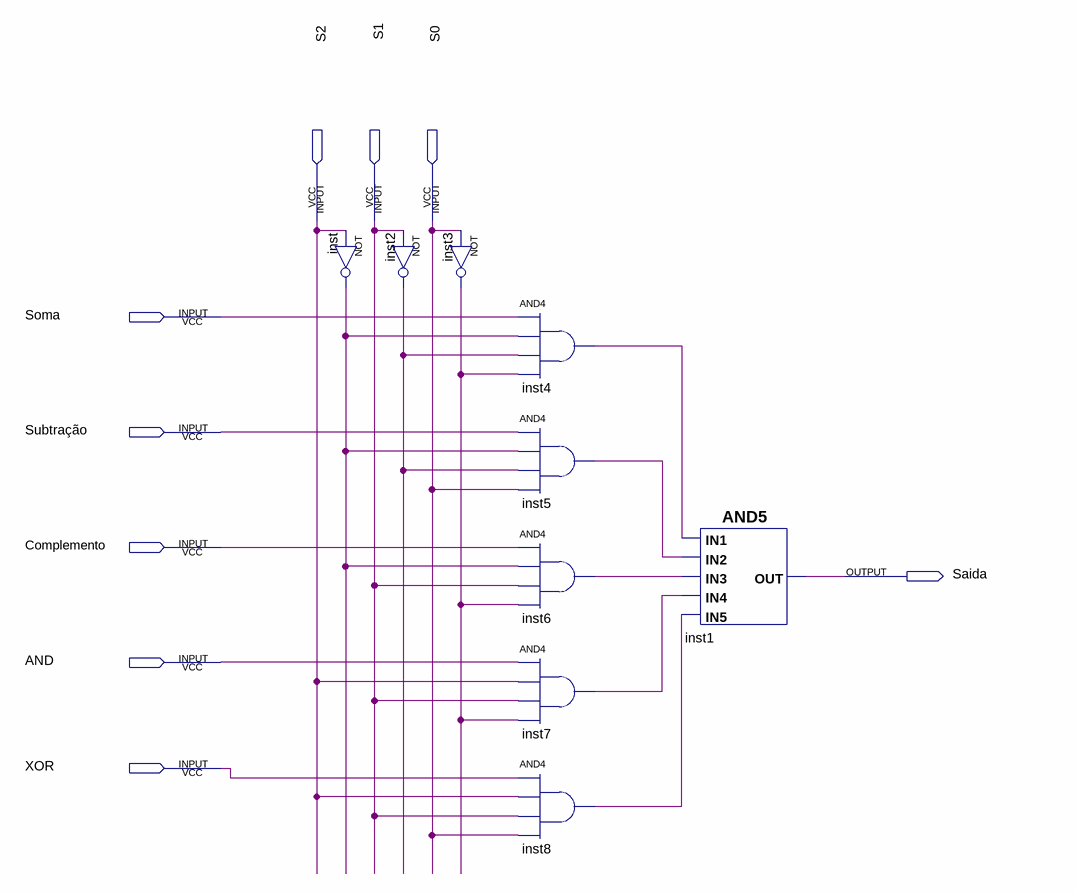
[diagram p0: schematic sheet]
// Quartus schematic Multiplexador_4bits.bdf as structural Verilog: 9 symbols, 9 pins
module Multiplexador_4bits (
  input  S2,
  input  S1,
  input  S0,
  input  Soma,
  input  \Subtração ,
  input  Complemento,
  input  AND,
  input  XOR,
  output Saida
);

  wire inst2_out, inst3_out, inst4_out, inst5_out, inst6_out, inst7_out, inst8_out, inst_out;

  not inst (inst_out, S2);
  not inst2 (inst2_out, S1);
  not inst3 (inst3_out, S0);
  and inst4 (inst4_out, Soma, inst_out, inst2_out, inst3_out);
  and inst5 (inst5_out, \Subtração , inst_out, inst2_out, S0);
  and inst6 (inst6_out, Complemento, inst_out, S1, inst3_out);
  and inst7 (inst7_out, AND, S2, S1, inst3_out);
  and inst8 (inst8_out, XOR, S2, S1, S0);
  and inst1 (Saida, inst4_out, inst5_out, inst6_out, inst7_out, inst8_out);
endmodule
